# Altium project Qbot.PrjPCB
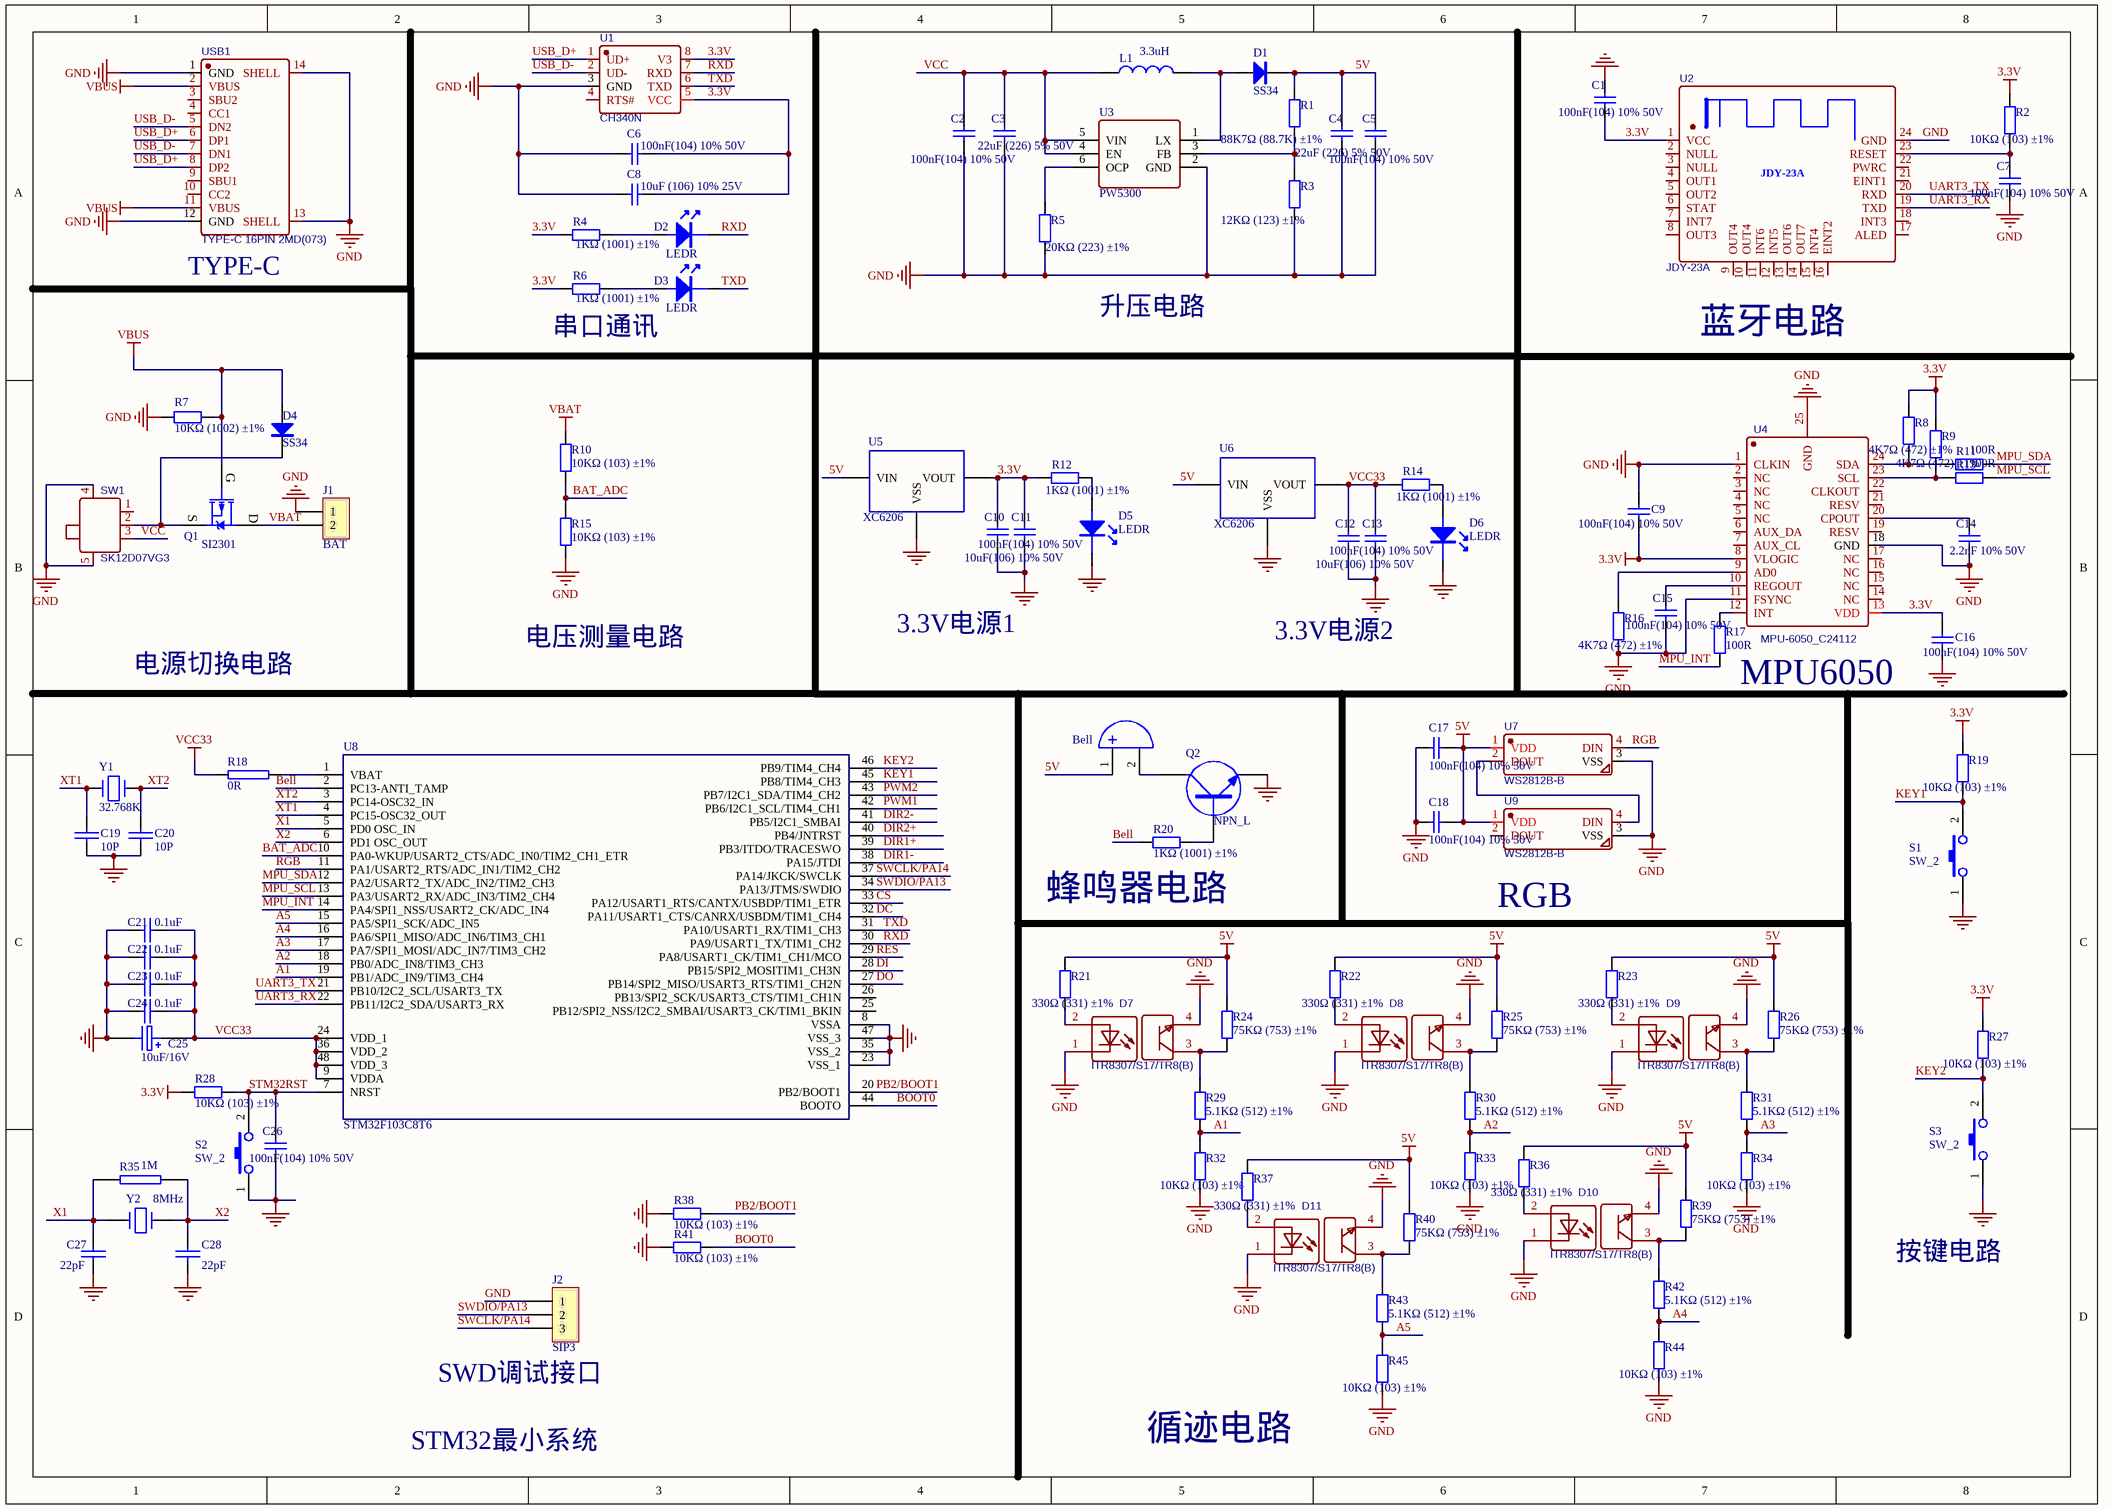
[diagram p0: Qbot.SchDoc]
2 sheets, 114 parts. Net scope: global (net labels, ports and power ports of the same name join across sheets).
Board file: Qbot.PcbDoc
Sheets:
  Qbot.SchDoc
  Qbot2.SchDoc

## Sheet Qbot.SchDoc
size A3

### Parts
C1  100nF(104) 10% 50V  [LC-0805_C]
C2  100nF(104) 10% 50V  [LC-0805_C]
C3  22uF (226) 5% 50V  [LC-0805_C]
C4  22uF (226) 5% 50V  [LC-0805_C]
C5  100nF(104) 10% 50V  [LC-0805_C]
C6  100nF(104) 10% 50V  [LC-0805_C]
C7  100nF(104) 10% 50V  [LC-0805_C]
C8  10uF (106) 10% 25V  [LC-0805_C]
C9  100nF(104) 10% 50V  [LC-0805_C]
C10  10uF(106) 10% 50V  [LC-0805_C]
C11  100nF(104) 10% 50V  [LC-0805_C]
C12  10uF(106) 10% 50V  [LC-0805_C]
C13  100nF(104) 10% 50V  [LC-0805_C]
C14  2.2nF 10% 50V  [LC-0805_C]
C15  100nF(104) 10% 50V  [LC-0805_C]
C16  100nF(104) 10% 50V  [LC-0805_C]
C17  100nF(104) 10% 50V  [LC-0805_C]
C18  100nF(104) 10% 50V  [LC-0805_C]
C19  10P  [LC-0805_C]
C20  10P  [LC-0805_C]
C21  0.1uF  [LC-0805_C]
C22  0.1uF  [LC-0805_C]
C23  0.1uF  [LC-0805_C]
C24  0.1uF  [LC-0805_C]
C25  10uF/16V  [LC-0805_C]
C26  100nF(104) 10% 50V  [LC-0805_C]
C27  22pF  [LC-0805_C]
C28  22pF  [LC-0805_C]
D1  SS34  [SMA]
D2  LEDR  [LED0805G]
D3  LEDR  [LED0805G]
D4  SS34  [SMA]
D5  LEDR  [LED0805G]
D6  LEDR  [LED0805G]
D7  ITR8307/S17/TR8(B)  [OPTO-SMD_ITR8307-S17-TR8-B-BL]
D8  ITR8307/S17/TR8(B)  [OPTO-SMD_ITR8307-S17-TR8-B-BL]
D9  ITR8307/S17/TR8(B)  [OPTO-SMD_ITR8307-S17-TR8-B-BL]
D10  ITR8307/S17/TR8(B)  [OPTO-SMD_ITR8307-S17-TR8-B-BL]
D11  ITR8307/S17/TR8(B)  [OPTO-SMD_ITR8307-S17-TR8-B-BL]
J1  BAT  [XH2.54-LI-2P]
J2  SIP3  [HDR2.54-WI-3P]
L1  3.3uH  [IND-SMD_L4.6-W4.1]
LS1  Bell  [BELL]
Q1  SI2301  [SOT23]
Q2  NPN_L  [SOT-23_S8050]
R1  88K7Ω (88.7K) ±1%  [LC-0805_R]
R2  10KΩ (103) ±1%  [LC-0805_R]
R3  12KΩ (123) ±1%  [LC-0805_R]
R4  1KΩ (1001) ±1%  [LC-0805_R]
R5  20KΩ (223) ±1%  [LC-0805_R]
R6  1KΩ (1001) ±1%  [LC-0805_R]
R7  10KΩ (1002) ±1%  [LC-0805_R]
R8  4K7Ω (472) ±1%  [LC-0805_R]
R9  4K7Ω (472) ±1%  [LC-0805_R]
R10  10KΩ (103) ±1%  [LC-0805_R]
R11  100R  [LC-0805_R]
R12  1KΩ (1001) ±1%  [LC-0805_R]
R13  100R  [LC-0805_R]
R14  1KΩ (1001) ±1%  [LC-0805_R]
R15  10KΩ (103) ±1%  [LC-0805_R]
R16  4K7Ω (472) ±1%  [LC-0805_R]
R17  100R  [LC-0805_R]
R18  0R  [LC-0805_R]
R19  10KΩ (103) ±1%  [LC-0805_R]
R20  1KΩ (1001) ±1%  [LC-0805_R]
R21  330Ω (331) ±1%  [LC-0805_R]
R22  330Ω (331) ±1%  [LC-0805_R]
R23  330Ω (331) ±1%  [LC-0805_R]
R24  75KΩ (753) ±1%  [LC-0805_R]
R25  75KΩ (753) ±1%  [LC-0805_R]
R26  75KΩ (753) ±1%  [LC-0805_R]
R27  10KΩ (103) ±1%  [LC-0805_R]
R28  10KΩ (103) ±1%  [LC-0805_R]
R29  5.1KΩ (512) ±1%  [LC-0805_R]
R30  5.1KΩ (512) ±1%  [LC-0805_R]
R31  5.1KΩ (512) ±1%  [LC-0805_R]
R32  10KΩ (103) ±1%  [LC-0805_R]
R33  10KΩ (103) ±1%  [LC-0805_R]
R34  10KΩ (103) ±1%  [LC-0805_R]
R35  1M  [LC-0805_R]
R36  330Ω (331) ±1%  [LC-0805_R]
R37  330Ω (331) ±1%  [LC-0805_R]
R38  10KΩ (103) ±1%  [LC-0805_R]
R39  75KΩ (753) ±1%  [LC-0805_R]
R40  75KΩ (753) ±1%  [LC-0805_R]
R41  10KΩ (103) ±1%  [LC-0805_R]
R42  5.1KΩ (512) ±1%  [LC-0805_R]
R43  5.1KΩ (512) ±1%  [LC-0805_R]
R44  10KΩ (103) ±1%  [LC-0805_R]
R45  10KΩ (103) ±1%  [LC-0805_R]
S1  SW_2  [TSW SMD-3*6*2.5]
S2  SW_2  [TSW SMD-3*6*2.5]
S3  SW_2  [TSW SMD-3*6*2.5]
SW1  SK12D07VG3  [SW-TH_SK-12D07-VG3]
U1  CH340N  [SOP8]
U2  JDY-23A  [JDY-23A]
U3  PW5300  [SOT23-6L]
U4  MPU-6050_C24112  [QFN24]
U5  XC6206  [SOT-23_TL431]
U6  XC6206  [SOT-23_TL431]
U7  WS2812B-B  [LED-SMD_4P-L5.0-W5.0-TL_WS2812B-B]
U8  STM32F103C8T6  [STM32F103C8T6_LQFP48]
U9  WS2812B-B  [LED-SMD_4P-L5.0-W5.0-TL_WS2812B-B]
USB1  TYPE-C 16PIN 2MD(073)  [USB-C-SMD_TYPE-C-6PIN-2MD-073]
Y1  32.768K  [OSC-3x10-WI-A]
Y2  8MHz  [OSC HC-49S]

### Nets
3.3V: C1.2 C6.1 C8.1 C9.1 C10.1 C11.1 C16.2 R2.1 R4.1 R6.1 R8.1 R9.1 R12.1 R19.1 R27.1 R28.2 U1.5(VCC) U1.8(V3) U2.1(VCC) U4.8(VLOGIC) U4.13(VDD) U5.2(VOUT)
5V: C4.2 C5.1 C17.1 C18.1 D1.2(K) LS1.1(A) R1.2 R21.2 R22.2 R23.2 R24.1 R25.1 R26.1 R36.2 R37.2 R39.1 R40.1 U5.3(VIN) U6.3(VIN) U7.1(VDD) U9.1(VDD)
GND: C1.1 C2.2 C3.1 C4.1 C5.2 C6.2 C7.2 C8.2 C9.2 C10.2 C11.2 C12.2 C13.2 C14.2 C15.2 C16.1 C17.2 C18.2 C19.1 C20.1 C21.2 C22.2 C23.2 C24.2 C25.2 C26.2 C27.2 C28.2 D5.2 D6.2 D7.1 D7.4 D8.1 D8.4 D9.1 D9.4 D10.1 D10.4 D11.1 D11.4 J1.1 J2.1 Q2.2(E) R3.1 R5.1 R7.1 R15.2 R16.2 R32.2 R33.2 R34.2 R38.1 R41.1 R44.2 R45.2 S1.1 S2.1 S3.1 SW1.4 SW1.5 U1.3(GND) U2.24(GND) U3.2(GND) U4.1(CLKIN) U4.11(FSYNC) U4.18(GND) U4.25(GND) U5.1(VSS) U6.1(VSS) U7.3(VSS) U8.8(VSSA) U8.23(VSS_1) U8.35(VSS_2) U8.47(VSS_3) U9.3(VSS) USB1.1(GND) USB1.12(GND) USB1.13(SHELL) USB1.14(SHELL)
VBAT: J1.2 Q1.3(D) R10.1
VBUS: D4.1(A) Q1.1(G) R7.2 USB1.2(VBUS) USB1.11(VBUS)
VCC33: C12.1 C13.1 C21.1 C22.1 C23.1 C24.1 C25.1 R14.1 R18.1 U6.2(VOUT) U8.9(VDDA) U8.24(VDD_1) U8.36(VDD_2) U8.48(VDD_3)
A1: R29.1 R32.1 U8.19(PB1/ADC_IN9/TIM3_CH4)
A2: R30.1 R33.1 U8.18(PB0/ADC_IN8/TIM3_CH3)
A3: R31.1 R34.1 U8.17(PA7/SPI1_MOSI/ADC_IN7/TIM3_CH2)
A4: R42.1 R44.1 U8.16(PA6/SPI1_MISO/ADC_IN6/TIM3_CH1)
A5: R43.1 R45.1 U8.15(PA5/SPI1_SCK/ADC_IN5)
BAT_ADC: R10.2 R15.1 U8.10(PA0-WKUP/USART2_CTS/ADC_IN0/TIM2_CH1_ETR)
Bell: R20.1 U8.2(PC13-ANTI_TAMP)
BOOT0: R41.2 U8.44(BOOTO)
CS: U8.33(PA12/USART1_RTS/CANTX/USBDP/TIM1_ETR)
DC: U8.32(PA11/USART1_CTS/CANRX/USBDM/TIM1_CH4)
DI: U8.28(PB15/SPI2_MOSITIM1_CH3N)
DIR1+: U8.39(PB3/ITDO/TRACESWO)
DIR1-: U8.38(PA15/JTDI)
DIR2+: U8.40(PB4/JNTRST)
DIR2-: U8.41(PB5/I2C1_SMBAI)
DO: U8.27(PB14/SPI2_MISO/USART3_RTS/TIM1_CH2N)
KEY1: R19.2 S1.2 U8.45(PB8/TIM4_CH3)
KEY2: R27.2 S3.2 U8.46(PB9/TIM4_CH4)
MPU_INT: R17.1 U8.14(PA4/SPI1_NSS/USART2_CK/ADC_IN4)
MPU_SCL: R13.2 U8.13(PA3/USART2_RX/ADC_IN3/TIM2_CH4)
MPU_SDA: R11.2 U8.12(PA2/USART2_TX/ADC_IN2/TIM2_CH3)
PB2/BOOT1: R38.2 U8.20(PB2/BOOT1)
PWM1: U8.42(PB6/I2C1_SCL/TIM4_CH1)
PWM2: U8.43(PB7/I2C1_SDA/TIM4_CH2)
RES: U8.29(PA8/USART1_CK/TIM1_CH1/MCO)
RGB: U7.4(DIN) U8.11(PA1/USART2_RTS/ADC_IN1/TIM2_CH2)
RXD: D2.2 U1.7(RXD) U8.30(PA9/USART1_TX/TIM1_CH2)
STM32RST: C26.1 R28.1 S2.2 U8.7(NRST)
SWCLK/PA14: J2.3 U8.37(PA14/JKCK/SWCLK)
SWDIO/PA13: J2.2 U8.34(PA13/JTMS/SWDIO)
TXD: D3.2 U1.6(TXD) U8.31(PA10/USART1_RX/TIM1_CH3)
UART3_RX: U2.19(TXD) U8.22(PB11/I2C2_SDA/USART3_RX)
UART3_TX: U2.20(RXD) U8.21(PB10/I2C2_SCL/USART3_TX)
USB_D+: U1.1(UD+) USB1.6(DP1) USB1.8(DP2)
USB_D-: U1.2(UD-) USB1.5(DN2) USB1.7(DN1)
VCC: C2.1 C3.2 L1.1 SW1.3 U3.4(EN) U3.5(VIN)
X1: C27.1 R35.1 U8.5(PD0_OSC_IN) Y2.1
X2: C28.1 R35.2 U8.6(PD1_OSC_OUT) Y2.2
XT1: C19.2 U8.4(PC15-OSC32_OUT) Y1.2
XT2: C20.2 U8.3(PC14-OSC32_IN) Y1.1
NetC7_1: C7.1 R2.2 U2.23(RESET)
NetC14_1: C14.1 U4.20(CPOUT)
NetC15_1: C15.1 U4.10(REGOUT)
NetD1_1: D1.1(A) L1.2 U3.1(LX)
NetD2_1: D2.1 R4.2
NetD3_1: D3.1 R6.2
NetD4_2: D4.2(K) Q1.2(S) SW1.2
NetD5_1: D5.1 R12.2
NetD6_1: D6.1 R14.2
NetD7_2: D7.2 R21.1
NetD7_3: D7.3 R24.2 R29.2
NetD8_2: D8.2 R22.1
NetD8_3: D8.3 R25.2 R30.2
NetD9_2: D9.2 R23.1
NetD9_3: D9.3 R26.2 R31.2
NetD10_2: D10.2 R36.1
NetD10_3: D10.3 R39.2 R42.2
NetD11_2: D11.2 R37.1
NetD11_3: D11.3 R40.2 R43.2
NetLS1_2: LS1.2(B) Q2.3(C)
NetQ2_1: Q2.1(B) R20.2
NetR1_1: R1.1 R3.2 U3.3(FB)
NetR5_2: R5.2 U3.6(OCP)
NetR8_2: R8.2 R11.1 U4.24(SDA)
NetR9_2: R9.2 R13.1 U4.23(SCL)
NetR16_1: R16.1 U4.9(AD0)
NetR17_2: R17.2 U4.12(INT)
NetR18_2: R18.2 U8.1(VBAT)
NetU7_2: U7.2(DOUT) U9.4(DIN)

Not connected (* = marked no-connect by the designer): SW1 1; U1 4(RTS#); U2 2(NULL) 3(NULL) 4(OUT1) 5(OUT2) 6(STAT) 7(INT7) 8(OUT3) 9(OUT4) 10(OUT4) 11(INT6) 12(INT5) 13(OUT6) 14(OUT7) 15(INT4) 16(EINT2) 17(ALED) 18(INT3) 21(EINT1) 22(PWRC); U4 2(NC) 3(NC) 4(NC) 5(NC) 6(AUX_DA) 7(AUX_CL) 14(NC) 15(NC) 16(NC) 17(NC) 19(RESV) 21(RESV) 22(CLKOUT); U8 25(PB12/SPI2_NSS/I2C2_SMBAI/USART3_CK/TIM1_BKIN) 26(PB13/SPI2_SCK/USART3_CTS/TIM1_CH1N); U9 2(DOUT); USB1 3(SBU2) 4(CC1) 9(SBU1) 10(CC2)

### Notes on the sheet
- (near USB1) TYPE-C
- 升压电路
- (near R6) 串口通讯
- (near U2) 蓝牙电路
- 电压测量电路
- 3.3V电源1
- 3.3V电源2
- 电源切换电路
- (near R17) MPU6050
- (near R20) 蜂鸣器电路
- (near U9) RGB
- 按键电路
- (near J2) SWD调试接口
- STM32最小系统
- 循迹电路

### Library data of the parts
C1 C2 C5-C7 C9-C18 C26 = 0805 100nF(104) 10% 50V: 贴片电容; ComponentLink1Description: 供应商链接; ComponentLink1URL: http://www.szlcsc.com/product/details_50686.html; Package: 0805; Supplier: LC; SuppliersPartNumber: C49678
C3 C4 = 0805 22pF (220) 5% 50V: 贴片电容; ComponentLink1Description: 供应商链接; ComponentLink1URL: http://www.szlcsc.com/product/details_2156.html; Package: 0805; Supplier: LC; SuppliersPartNumber: C1804
C8 = 0805 10uF (106) 10% 25V: 贴片电容; ComponentLink1Description: 供应商链接; ComponentLink1URL: http://www.szlcsc.com/product/details_16532.html; Package: 0805; Supplier: LC; SuppliersPartNumber: C15850
C19 C20 = CAP
C21-C24 C27 C28 = CAP: Capacitor
C25 = ELECTRO1: Electrolytic Capacitor
D1 D4 = SS34: 肖特基二极管; 版权归属: 源创客; 属性: 40V/3A; BOM名称: 肖特基二极管; 学习资源: www.ooocke.com
D2 D3 D5 D6 = LED
D7-D11 = ITR8307/S17/TR8(B): BOM_Manufacturer: EVERLIGHT; BOM_Supplier: LCSC; BOM_Manufacturer Part: ITR8307/S17/TR8(B); BOM_Supplier Part: C81632; BOM_JLCPCB Part Class: Extended Part; spicePre: K; spiceSymbolName: ITR8307/S17/TR8(B)
J1 = SIP2: jointbar
J2 = SIP3: jointbar
L1 = L: 小功率贴片电感; 版权归属: 源创客; BOM名称: 小功率贴片电感; 学习资源: www.ooocke.com
LS1 = Bell: Electrical Bell; Published: 24-Mar-1999; LatestRevisionDate: 17-Jul-2002; LatestRevisionNote: Re-released for DXP Platform.; Publisher: Altium Limited
Q1 = SI2301: P沟道场效应管; 版权归属: 源创客; BOM名称: P沟道场效应管; 学习资源: www.ooocke.com
R1-R6 R8-R17 R19-R34 R36-R45 = 0805 1KΩ (1001) 1%: 贴片电阻; ComponentLink1Description: 供应商链接; ComponentLink1URL: http://www.szlcsc.com/product/details_18201.html; Package: 0805; Supplier: LC; SuppliersPartNumber: C17513
R7 = 0805 10KΩ (1002) 1%: 贴片电阻; ComponentLink1Description: 供应商链接; ComponentLink1URL: http://www.szlcsc.com/product/details_18102.html; Package: 0805; Supplier: LC; SuppliersPartNumber: C17414
R18 = RES
R35 = RES2
SW1 = SK12D07VG6: BOM_Manufacturer: SHOU HAN(首韩); Contributor: LCSC; BOM_Supplier: LCSC; BOM_Supplier Part: C2681575; BOM_Manufacturer Part: SK12D07VG6; BOM_JLCPCB Part Class: Extended Part; spicePre: S; spiceSymbolName: SK12D07VG6
U1 = CH340N: BOM_Manufacturer: WCH(Jiangsu Qin Heng); subpart_no: 1; Contributor: LCSC; BOM_Supplier: LCSC; BOM_Supplier Part: C506813; BOM_Manufacturer Part: CH340N; BOM_JLCPCB Part Class: Extended Part; spicePre: U; spiceSymbolName: CH340N
U2 = JDY-23A: BOM_Manufacturer: TTCIOTSDK; BOM_Manufacturer Part: HY-40R204P; Contributor: LCSC; BOM_Supplier: LCSC; BOM_Supplier Part: C172803; BOM_JLCPCB Part Class: Extended Part; spicePre: U; spiceSymbolName: HY-40R204P
U4 = MPU-6050_C24112: BOM_Manufacturer: InvenSense; sourceId: 1T5FDZYC8; timeStamp: 1462265206; BOM_Supplier: LCSC; BOM_Manufacturer Part: MPU-6050; BOM_Supplier Part: C24112; BOM_JLCPCB Part Class: Basic Part; spicePre: U; spiceSymbolName: MPU-6050_C24112
U7 U9 = WS2812B-B: BOM_Manufacturer: Worldsemi; Contributor: LCSC; BOM_Supplier: LCSC; BOM_Manufacturer Part: WS2812B-B; BOM_Supplier Part: C114586; BOM_JLCPCB Part Class: Extended Part; spicePre: L; spiceSymbolName: WS2812B-B
USB1 = TYPE-C 16PIN 2MD(073): BOM_Manufacturer: SHOU HAN(首韩); Contributor: LCSC; BOM_Supplier: LCSC; BOM_Supplier Part: C2765186; BOM_Manufacturer Part: TYPE-C 16PIN 2MD(073); BOM_JLCPCB Part Class: Extended Part; spicePre: U; spiceSymbolName: TYPE-C 16PIN 2MD(073)
Y1 = CRYSTAL: 晶振
Y2 = XTAL: Crystal

## Sheet Qbot2.SchDoc
size A3
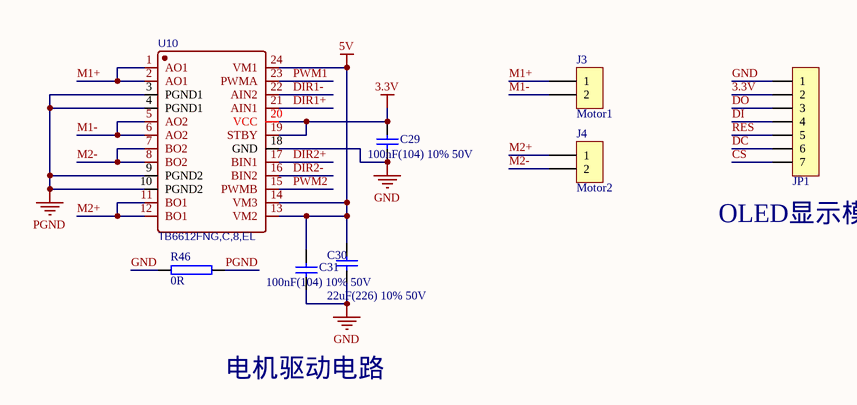
[diagram p1: Qbot2.SchDoc]

### Parts
C29  100nF(104) 10% 50V  [LC-0805_C]
C30  22uF(226) 10% 50V  [CD B(3528)]
C31  100nF(104) 10% 50V  [LC-0805_C]
J3  Motor1  [CONN-TH_1.25T-2A_1.25T-2A]
J4  Motor2  [CONN-TH_1.25T-2A_1.25T-2A]
JP1  HDR-1X7  [HDR2.54-M-LI-7P]  (value not drawn)
R46  0R  [LC-0805_R]
U10  TB6612FNG,C,8,EL  [SSOP24]

### Nets
3.3V: C29.2 JP1.2 U10.19(STBY) U10.20(VCC)
5V: C30.2 C31.2 U10.13(VM2) U10.14(VM3) U10.24(VM1)
GND: C29.1 C30.1 C31.1 JP1.1 R46.1 U10.18(GND)
PGND: R46.2 U10.3(PGND1) U10.4(PGND1) U10.9(PGND2) U10.10(PGND2)
CS: JP1.7
DC: JP1.6
DI: JP1.4
DIR1+: U10.21(AIN1)
DIR1-: U10.22(AIN2)
DIR2+: U10.17(BIN1)
DIR2-: U10.16(BIN2)
DO: JP1.3
M1+: J3.1 U10.1(AO1) U10.2(AO1)
M1-: J3.2 U10.5(AO2) U10.6(AO2)
M2+: J4.1 U10.11(BO1) U10.12(BO1)
M2-: J4.2 U10.7(BO2) U10.8(BO2)
PWM1: U10.23(PWMA)
PWM2: U10.15(PWMB)
RES: JP1.5

### Notes on the sheet
- (near JP1) OLED显示模块
- 电机驱动电路

### Library data of the parts
C29-C31 = 0805 100nF(104) 10% 50V: 贴片电容; ComponentLink1Description: 供应商链接; ComponentLink1URL: http://www.szlcsc.com/product/details_50686.html; Package: 0805; Supplier: LC; SuppliersPartNumber: C49678
J3 J4 = SIP2: jointbar
JP1 = Header 7: 7P接插件; 版权归属: 源创客; BOM名称: 7P接插件; 学习资源: www.ooocke.com
R46 = RES
U10 = TB6612FNG,C,8,EL: BOM_Manufacturer: TOSHIBA; Contributor: LCSC; BOM_Supplier: LCSC; BOM_Manufacturer Part: TB6612FNG,C,8,EL; BOM_Supplier Part: C141517; BOM_JLCPCB Part Class: Extended Part; spicePre: U; spiceSymbolName: TB6612FNG,C,8,EL

## Nets that join several sheets
3.3V: Qbot (22 pins), Qbot2 (C29.2 JP1.2 U10.19 U10.20)
5V: Qbot (21 pins), Qbot2 (5 pins)
GND: Qbot (79 pins), Qbot2 (6 pins)
CS: Qbot (U8.33), Qbot2 (JP1.7)
DC: Qbot (U8.32), Qbot2 (JP1.6)
DI: Qbot (U8.28), Qbot2 (JP1.4)
DIR1+: Qbot (U8.39), Qbot2 (U10.21)
DIR1-: Qbot (U8.38), Qbot2 (U10.22)
DIR2+: Qbot (U8.40), Qbot2 (U10.17)
DIR2-: Qbot (U8.41), Qbot2 (U10.16)
DO: Qbot (U8.27), Qbot2 (JP1.3)
PWM1: Qbot (U8.42), Qbot2 (U10.23)
PWM2: Qbot (U8.43), Qbot2 (U10.15)
RES: Qbot (U8.29), Qbot2 (JP1.5)